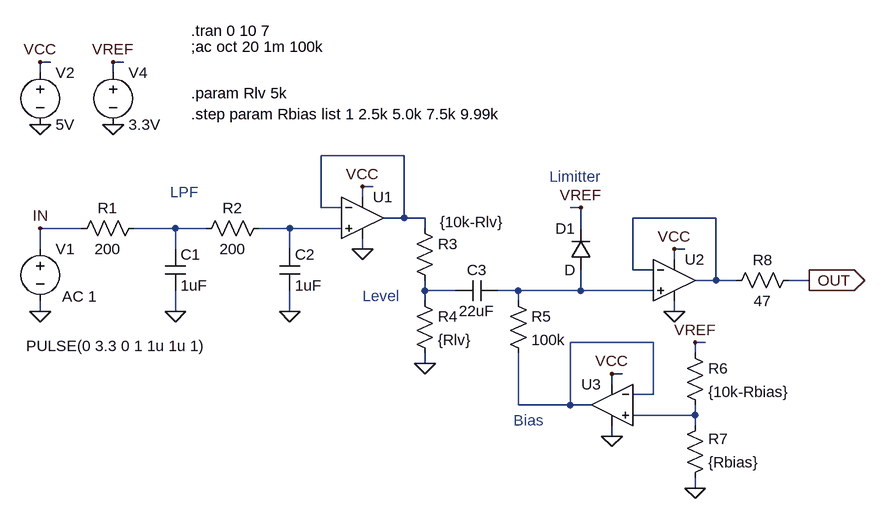
[diagram p0: schematic ArduinoLFO_Ouput_Board_Bias(OPAMP)_Limitter.asc]
ArduinoLFO_Ouput_Board_Bias(OPAMP)_Limitter.asc, the LTspice schematic file:
Version 4
SHEET 1 1556 680
WIRE 208 -160 192 -160
WIRE 320 -160 304 -160
WIRE 192 -144 192 -160
WIRE 304 -144 304 -160
WIRE 752 -16 624 -16
WIRE 704 32 688 32
WIRE 688 48 688 32
WIRE 624 64 624 -16
WIRE 656 64 624 64
WIRE 1024 64 1008 64
WIRE 752 80 752 -16
WIRE 752 80 720 80
WIRE 784 80 752 80
WIRE 1232 80 1104 80
WIRE 256 96 192 96
WIRE 400 96 336 96
WIRE 448 96 400 96
WIRE 576 96 528 96
WIRE 656 96 576 96
WIRE 784 96 784 80
WIRE 1024 96 1024 64
WIRE 192 128 192 96
WIRE 400 128 400 96
WIRE 576 128 576 96
WIRE 688 128 688 112
WIRE 1184 128 1168 128
WIRE 1168 144 1168 128
WIRE 1104 160 1104 80
WIRE 1136 160 1104 160
WIRE 1232 176 1232 80
WIRE 1232 176 1200 176
WIRE 1264 176 1232 176
WIRE 1376 176 1344 176
WIRE 784 192 784 176
WIRE 832 192 784 192
WIRE 928 192 896 192
WIRE 1024 192 1024 160
WIRE 1024 192 928 192
WIRE 1136 192 1024 192
WIRE 784 208 784 192
WIRE 928 208 928 192
WIRE 192 224 192 208
WIRE 400 224 400 192
WIRE 576 224 576 192
WIRE 1168 224 1168 208
WIRE 1136 272 1008 272
WIRE 1216 272 1200 272
WIRE 1200 288 1200 272
WIRE 784 304 784 288
WIRE 1088 320 1072 320
WIRE 1072 336 1072 320
WIRE 1136 352 1136 272
WIRE 1136 352 1104 352
WIRE 928 368 928 288
WIRE 1008 368 1008 272
WIRE 1008 368 928 368
WIRE 1040 368 1008 368
WIRE 1200 384 1200 368
WIRE 1200 384 1104 384
WIRE 1200 400 1200 384
WIRE 1072 416 1072 400
WIRE 1200 496 1200 480
FLAG 192 224 0
FLAG 192 96 IN
FLAG 400 224 0
FLAG 1376 176 OUT
IOPIN 1376 176 Out
FLAG 576 224 0
FLAG 688 32 VCC
FLAG 688 128 0
FLAG 192 -64 0
FLAG 192 -160 VCC
FLAG 784 304 0
FLAG 1168 128 VCC
FLAG 1168 224 0
FLAG 1024 64 VREF
FLAG 304 -64 0
FLAG 304 -160 VREF
FLAG 1072 320 VCC
FLAG 1072 416 0
FLAG 1200 496 0
FLAG 1200 272 VREF
SYMBOL voltage 192 112 R0
WINDOW 3 -22 165 Left 2
WINDOW 123 34 89 Left 2
WINDOW 39 0 0 Left 2
SYMATTR Value PULSE(0 3.3 0 1 1u 1u 1)
SYMATTR Value2 AC 1
SYMATTR InstName V1
SYMBOL cap 384 128 R0
SYMATTR InstName C1
SYMATTR Value 1uF
SYMBOL res 352 80 R90
WINDOW 0 0 56 VBottom 2
WINDOW 3 32 56 VTop 2
SYMATTR InstName R1
SYMATTR Value 200
SYMBOL cap 560 128 R0
SYMATTR InstName C2
SYMATTR Value 1uF
SYMBOL res 544 80 R90
WINDOW 0 0 56 VBottom 2
WINDOW 3 32 56 VTop 2
SYMATTR InstName R2
SYMATTR Value 200
SYMBOL Opamps\\UniversalOpamp2 688 80 R0
SYMATTR InstName U1
SYMBOL voltage 192 -160 R0
SYMATTR InstName V2
SYMATTR Value 5V
SYMBOL res 768 80 R0
WINDOW 3 39 6 Left 2
SYMATTR Value {10k-Rlv}
SYMATTR InstName R3
SYMBOL res 768 192 R0
SYMATTR InstName R4
SYMATTR Value {Rlv}
SYMBOL res 912 192 R0
SYMATTR InstName R5
SYMATTR Value 100k
SYMBOL cap 896 176 R90
WINDOW 0 0 32 VBottom 2
WINDOW 3 32 32 VTop 2
SYMATTR InstName C3
SYMATTR Value 22uF
SYMBOL Opamps\\UniversalOpamp2 1168 176 R0
SYMATTR InstName U2
SYMBOL diode 1040 160 R180
WINDOW 0 24 64 Left 2
WINDOW 3 24 0 Left 2
SYMATTR InstName D1
SYMBOL voltage 304 -160 R0
SYMATTR InstName V4
SYMATTR Value 3.3V
SYMBOL Opamps\\UniversalOpamp2 1072 368 M0
SYMATTR InstName U3
SYMBOL res 1184 272 R0
SYMATTR InstName R6
SYMATTR Value {10k-Rbias}
SYMBOL res 1184 496 M180
WINDOW 0 36 76 Left 2
WINDOW 3 36 40 Left 2
SYMATTR InstName R7
SYMATTR Value {Rbias}
SYMBOL res 1360 160 R90
WINDOW 0 0 56 VBottom 2
WINDOW 3 32 56 VTop 2
SYMATTR InstName R8
SYMATTR Value 47
TEXT 424 -208 Left 2 !.tran 0 10 7
TEXT 424 -184 Left 2 !;ac oct 20 1m 100k
TEXT 424 -112 Left 2 !.param Rlv 5k
TEXT 424 -80 Left 2 !.step param Rbias list 1 2.5k 5.0k 7.5k 9.99k
TEXT 392 40 Left 2 ;LPF
TEXT 688 200 Left 2 ;Level
TEXT 976 16 Left 2 ;Limitter
TEXT 920 392 Left 2 ;Bias

The netlist it stands for:
* ArduinoLFO_Ouput_Board_Bias(OPAMP)_Limitter.asc
V1 IN 0 PULSE(0 3.3 0 1 1u 1u 1) AC 1
C1 N003 0 1uF
R1 N003 IN 200
C2 N004 0 1uF
R2 N004 N003 200
XU1 N004 N001 VCC 0 N001 level.2 Avol=1Meg GBW=10Meg Slew=10Meg ilimit=25m rail=0 Vos=0 phimargin=45 en=0 enk=0 in=0 ink=0 Rin=500Meg  ; pins IN+ IN- V+ V- OUT
V2 VCC 0 5V
R3 N001 N005 {10k-Rlv}
R4 N005 0 {Rlv}
R5 N006 N007 100k
C3 N006 N005 22uF
XU2 N006 N002 VCC 0 N002 level.2 Avol=1Meg GBW=10Meg Slew=10Meg ilimit=25m rail=0 Vos=0 phimargin=45 en=0 enk=0 in=0 ink=0 Rin=500Meg  ; pins IN+ IN- V+ V- OUT
D1 N006 VREF D
V4 VREF 0 3.3V
XU3 N008 N007 VCC 0 N007 level.2 Avol=1Meg GBW=10Meg Slew=10Meg ilimit=25m rail=0 Vos=0 phimargin=45 en=0 enk=0 in=0 ink=0 Rin=500Meg  ; pins IN+ IN- V+ V- OUT
R6 VREF N008 {10k-Rbias}
R7 0 N008 {Rbias}
R8 OUT N002 47
.model D D
.lib standard.dio
.tran 0 10 7
;ac oct 20 1m 100k
.param Rlv 5k
.step param Rbias list 1 2.5k 5.0k 7.5k 9.99k
* LPF
* Level
* Limitter
* Bias
.lib UniversalOpamps2.sub
.backanno
.end